# EAGLE design Qwiic Joystick v1.1.1 (EAGLE 9.1.3)
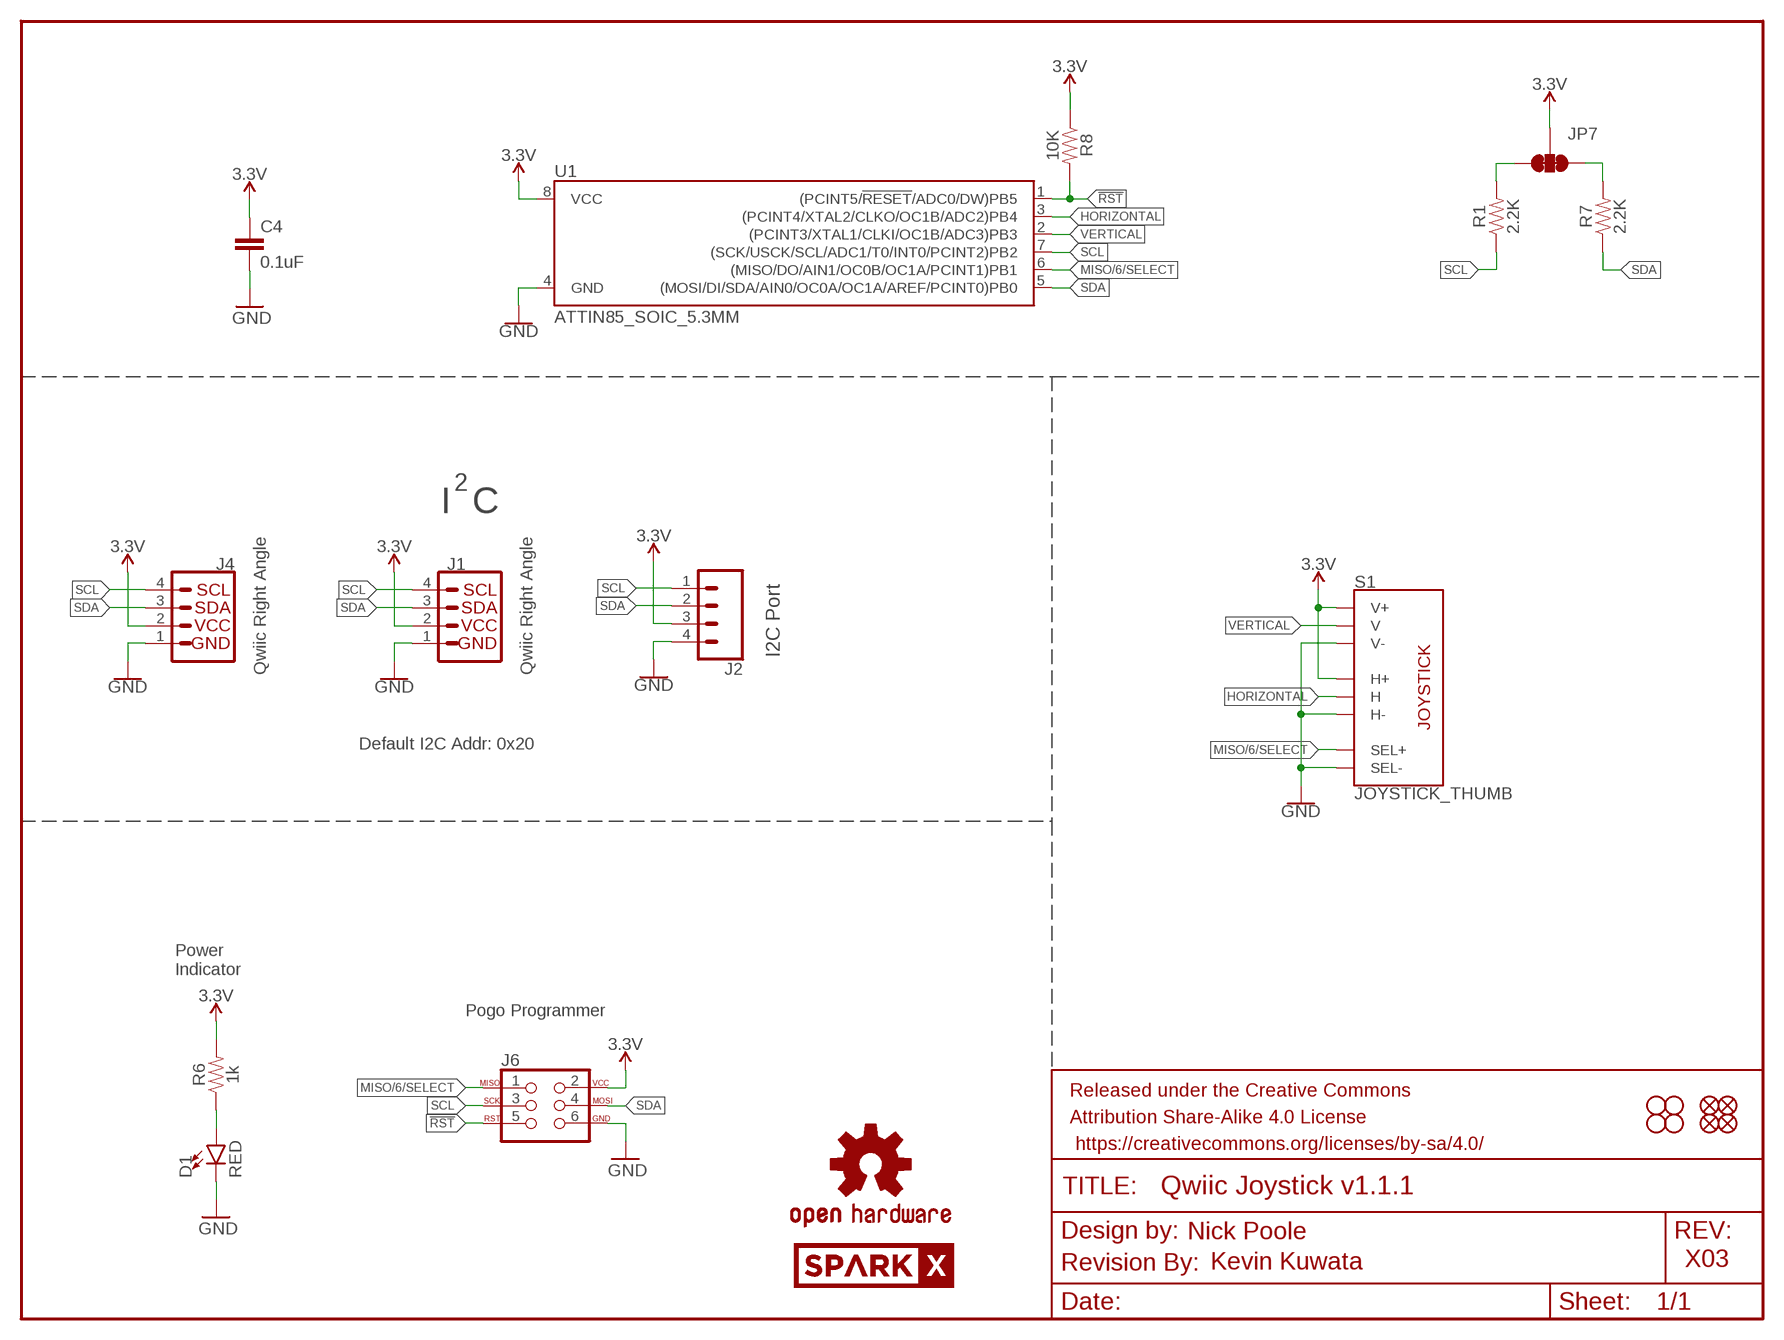
[diagram p0: schematic, sheet 1]

## Parts
C4  0.1uF  0.1UF-0603-25V-(+80/-20%)  [0603]
D1  RED  LED-RED0603  [LED-0603]
FRAME1  FRAME-LETTER  [CREATIVE_COMMONS]
H1  STAND-OFF  [STAND-OFF]
H2  STAND-OFF  [STAND-OFF]
H3  STAND-OFF  [STAND-OFF]
H4  STAND-OFF  [STAND-OFF]
J1  Qwiic Right Angle  I2C_STANDARDQWIIC  [1X04_1MM_RA]
J2  CONN_041X04_NO_SILK  [1X04_NO_SILK]
J4  Qwiic Right Angle  I2C_STANDARDQWIIC  [1X04_1MM_RA]
J6  AVR_SPI_PROG_3X2TESTPOINTS  [2X3_TEST_POINTS]
JP1  FIDUCIALUFIDUCIAL  [MICRO-FIDUCIAL]
JP2  FIDUCIALUFIDUCIAL  [MICRO-FIDUCIAL]
JP3  FIDUCIALUFIDUCIAL  [MICRO-FIDUCIAL]
JP6  FIDUCIALUFIDUCIAL  [MICRO-FIDUCIAL]
JP7  JUMPER-SMT_3_2-NC_TRACE_NO-SILK  [SMT-JUMPER_3_2-NC_TRACE_NO-SILK]
LOGO1  OSHW-LOGOMINI  [OSHW-LOGO-MINI]
LOGO2  REVISION  [REVISION]
R1  2.2K  4.7KOHM-0603-1/10W-1%  [0603]
R6  1k  1KOHM-0603-1/10W-1%  [0603]
R7  2.2K  4.7KOHM-0603-1/10W-1%  [0603]
R8  10K  330OHM-0603-1/10W-1%  [0603]
S1  JOYSTICK_THUMB  [JOYSTICK]
U1  ATTIN85_SOIC_5.3MM  [ATTINY85]
U$1  SPARKX-LOGO3  [SPARKX-SMALL]
U$2  SPARKX-LOGO3  [SPARKX-SMALL]

## Nets
3.3V: C4.1 J1.2 J2.3 J4.2 J6.2 JP7.2 R6.2 R8.1 S1.H1(H+) S1.V1(V+) U1.8(VCC)
!RST: J6.5 R8.2 U1.1((PCINT5/!RESET!/ADC0/DW)PB5)
GND: C4.2 D1.C J1.1 J2.4 J4.1 J6.6 S1.B2A(SEL-) S1.H3(H-) S1.V3(V-) U1.4(GND)
HORIZONTAL: S1.H2(H) U1.3((PCINT4/XTAL2/CLKO/OC1B/ADC2)PB4)
MISO/6/SELECT: J6.1 S1.B1A(SEL+) U1.6((MISO/DO/AIN1/OC0B/OC1A/PCINT1)PB1)
N$1: D1.A R6.1
N$2: JP7.1 R7.2
N$3: JP7.3 R1.2
SCL: J1.4 J2.1 J4.4 J6.3 R1.1 U1.7((SCK/USCK/SCL/ADC1/T0/INT0/PCINT2)PB2)
SDA: J1.3 J2.2 J4.3 J6.4 R7.1 U1.5((MOSI/DI/SDA/AIN0/OC0A/OC1A/AREF/PCINT0)PB0)
VERTICAL: S1.V2(V) U1.2((PCINT3/XTAL1/CLKI/OC1B/ADC3)PB3)

## Notes on the sheet
- 2
- I  C
- I2C Port
- Default I2C Addr: 0x20
- Power
  Indicator
- Pogo Programmer
- Nick Poole
- Kevin Kuwata | X03

## Library data of the parts
C4 = SparkFun-Capacitors:0.1UF: 0.1µF ceramic capacitors A capacitor is a passive two-terminal electrical component used to store electrical energy temporarily in an electric field.; PROD_ID: CAP-00810
D1 = SparkFun-LED:LED-RED: Red SMD LED Used in manufacturing of most products at SparkFun Packages: 0603 - SMD 0603 package [Product Link] <http://docs.avagotech.com/docs/AV02-0551EN> 0603 SMART - SMD 0603 SMART package ( more efficient and expensive)[Product Link] <http://www.osram-os.com/Graphics/XPic2/00077099_0.pdf> 1206 - SMD1206 package [Product Link] <https://www.sparkfun.com/datasheets/DevTools/LilyPad/Q150OVS4.pdff> SparkFun Products: Pro Mini 328 -5V <https://www.sparkfun.com/products/821> RedBoard <https://www.sparkfun.com/products/12757> IOIO-OTG <https://www.sparkfun.com/products/13613>; PROD_ID: DIO-00819
FRAME1 = SparkFun-Aesthetics:FRAME-LETTER: Schematic Frame - Letter Standard 8.5x11 US Letter frame
H1-H4 = SparkFun-Hardware:STAND-OFF: Stand Off Drill holes for mechanically mounting via screws, standoffs, etc. Note: Use the keepout ring to avoid running the screw head into surrounding components. Variant Overviews STAND-OFF - Mechanical footprint for a #4 phillips button head screw. STAND-OFF-TIGHT - Mechanical footprint for a #4 phillips button head screw, Example SparkFun Products Screw - Phillips Head (1/4", 4-40, 10 pack) <https://www.sparkfun.com/products/10453> (PRT-10453) Screw - Phillips Head (1/2", 4-40, 10 pack) <https://www.sparkfun.com/products/10452> (PRT-10452) Screw - Phillips Head (3/4", 4-40, 10 pack) <https://www.sparkfun.com/products/10451> (PRT-10451) Screw - Phillips Head (1", 4-40, 10 pack) <https://www.sparkfun.com/products/10450> (PRT-10450)
J1 J4 = SparkFun-Connectors:I2C_STANDARD: SparkFun I2C Standard Pinout Header SparkFun has standardized on a pinout for all I2C based sensor breakouts. This pinout allows I2C boards to be plugged directly into the headers on Arduino Uno compatible boards, and to be daisy chained easily. Example SparkFun Products: SparkFun Atmospheric Sensor Breakout - BME280 <https://www.sparkfun.com/products/13676> SparkFun Altitude/Pressure Sensor Breakout - MPL3115A2 <https://www.sparkfun.com/products/11084> SparkFun TOF Range Finder Sensor - VL6180 <https://www.sparkfun.com/products/12785>; PROD_ID: CONN-13694
J2 = SparkFun-Connectors:CONN_04: Multi connection point. Often used as Generic Header-pin footprint for 0.1 inch spaced/style header connections On any of the 0.1 inch spaced packages, you can populate with these: Break Away Headers - Straight <https://www.sparkfun.com/products/116> (PRT-00116) Break Away Male Headers - Right Angle <https://www.sparkfun.com/products/553> (PRT-00553) Female Headers <https://www.sparkfun.com/products/115> (PRT-00115) Break Away Headers - Machine Pin <https://www.sparkfun.com/products/117> (PRT-00117) Break Away Female Headers - Swiss Machine Pin <https://www.sparkfun.com/products/743> (PRT-00743) For SCREWTERMINALS and SPRING TERMINALS visit here: Screw Terimnals on SparkFun.com <https://www.sparkfun.com/search/results?term=Screw+Terminals> (5mm/3.5mm/2.54mm spacing) This device is also useful as a general connection point to wire up your design to another part of your project. Our various solder wires solder well into these plated through hole pads. Hook-Up Wire - Assortment (Stranded, 22 AWG) <https://www.sparkfun.com/products/11375> (PRT-11375) Hook-Up Wire - Assortment (Solid Core, 22 AWG) <https://www.sparkfun.com/products/11367> (PRT-11367) View the entire wire category on our website here <https://www.sparkfun.com/categories/141> Special notes: Molex polarized connector foot print use with SKU : PRT-08231 with associated crimp pins and housings. 1MM SMD Version SKU: PRT-10208; PROD_ID: CONN-09696
J6 = SparkFun-Connectors:AVR_SPI_PROG_3X2: AVR ISP 6 Pin This is the reduced ISP connector for AVR programming. Common on Arduino. This footprint will take up less PCB space and can be used with a 10-pin to 6-pin adapter such as SKU: BOB-08508 **Special note about "TEST_POINT" package. The stop mask is on the top side, so if you want your programming test points to be on the bottom of your board, make sure to place this package on the bottom side of the board. This also ensure that the orientation to program from the bottom side will be correct. SparkFun Products: SparkFun ISP Pogo Adapter <https://www.sparkfun.com/products/11591> - NS Tiny AVR Programmer <https://www.sparkfun.com/products/11801> -PTH
JP1-JP3 JP6 = SparkFun:FIDUCIAL: Fiducial Alignment Points Various fiducial points for machine vision alignment.
JP7 = SparkFun-Jumpers:JUMPER-SMT_3_2-NC_TRACE: Normally closed trace jumper (2 of 2 connections) This jumper has a trace between all three pads so they are normally closed (NC). Use a razor knife to open the connection(s). For best results follow the IPC guidelines for cutting traces: Cutout at least 0.063 mm (0.005 in). Remove all loose material to clean up the cut area. Seal the cut with an approved epoxy. Reapply solder to reclose the connection(s).
LOGO1 = SparkFun-Aesthetics:OSHW-LOGO: Open-Source Hardware (OSHW) Logo This logo indicates the piece of hardware it is found on incorporates a OSHW license and/or adheres to the definition of open source hardware found here: http://freedomdefined.org/OSHW
LOGO2 = SparkFun-Aesthetics:REVISION: "Revision By" Text Preceding text for revisor documentation. Includes schematic text on "symbols" layer, and board text on tDoc.
R1 R7 = SparkFun-Resistors:4.7KOHM: 4.7kΩ resistor A resistor is a passive two-terminal electrical component that implements electrical resistance as a circuit element. Resistors act to reduce current flow, and, at the same time, act to lower voltage levels within circuits. - Wikipedia; PROD_ID: RES-07857; VALUE: 4.7k
R6 = SparkFun-Resistors:1KOHM: 1kΩ resistor A resistor is a passive two-terminal electrical component that implements electrical resistance as a circuit element. Resistors act to reduce current flow, and, at the same time, act to lower voltage levels within circuits. - Wikipedia; PROD_ID: RES-07856
R8 = SparkFun-Resistors:330OHM: 330Ω resistor A resistor is a passive two-terminal electrical component that implements electrical resistance as a circuit element. Resistors act to reduce current flow, and, at the same time, act to lower voltage levels within circuits. - Wikipedia; PROD_ID: RES-00818; VALUE: 330
S1 = SparkFun-Switches:JOYSTICK_THUMB: Analog Thumb Joystick This is a joystick very similar to the ‘analog’ joysticks on PS2 (PlayStation 2) controllers. Directional movements are simply two potentiometers - one for each axis. Pots are ~10k each. This joystick also has a select button that is actuated when the joystick is pressed down. SparkFun Products Thumb Joystick <https://www.sparkfun.com/products/9032> (COM-09032) SparkFun Thumb Joystick Breakout <https://www.sparkfun.com/products/9110> (BOB-09110) SparkFun Joystick Shield Kit <https://www.sparkfun.com/products/9760> (DEV-09760); PROD_ID: COMP-09744; SF_SKU: COM-09032
U1 = attiny85:ATTIN85
U$1 U$2 = SparkX:SPARKX-LOGO

## Board
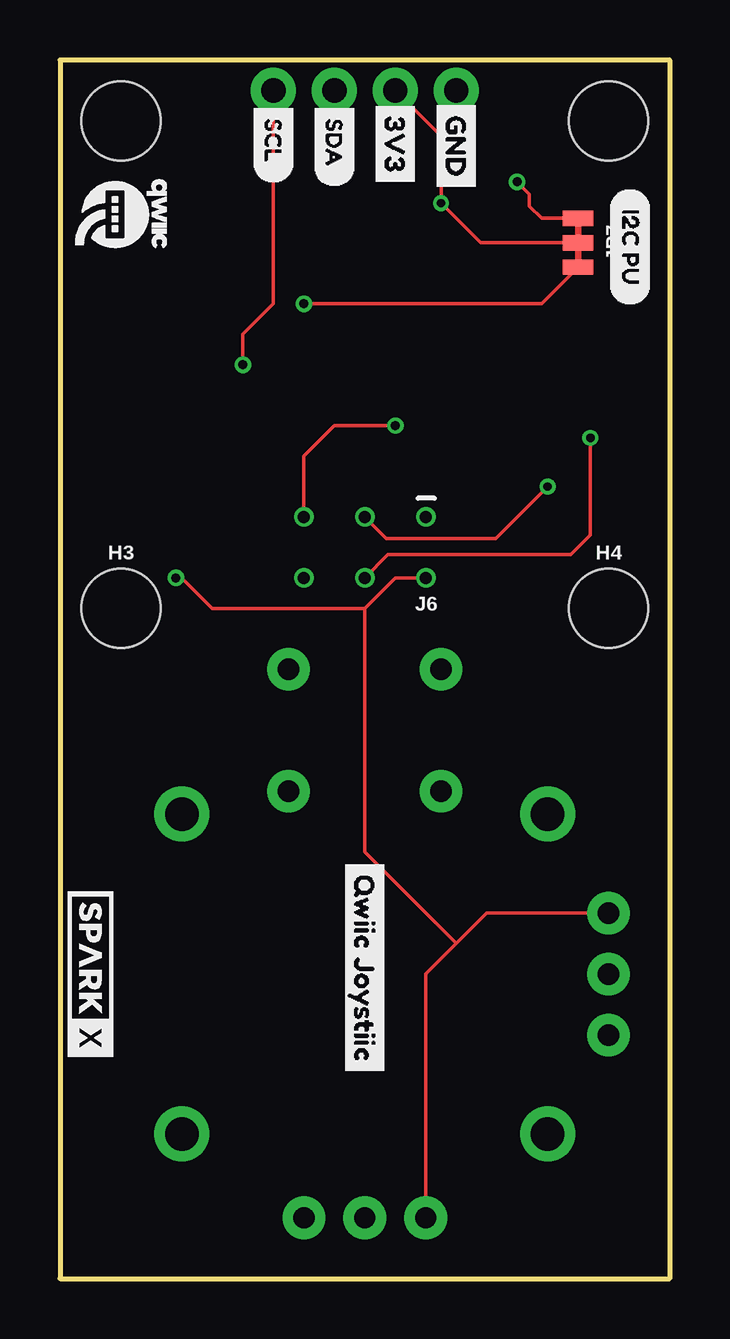
[diagram p1: board, top side]
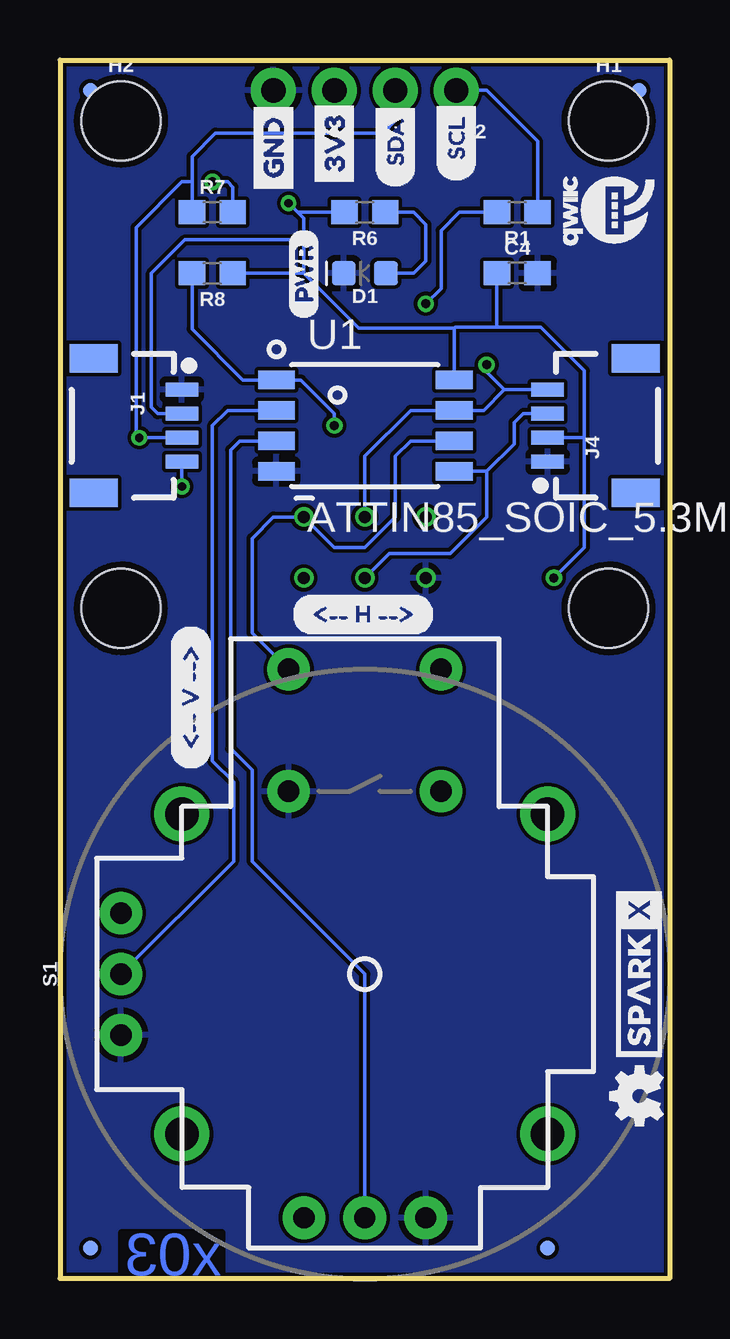
[diagram p2: board, bottom side, seen from below]

Size 25.4 x 50.8 mm. Coordinates in mm from the lower left corner, seen from the top.
Outline: 25.4,50.8 25.4,0 0,0 0,50.8 25.4,50.8
Copper layers (1*16): Top 0.035mm / dielectric 1.5mm / Bottom 0.035mm
Design rules "SparkFun-2-layer-PCBWay-LIMIT": minimum track width 6mil, minimum drill 0.3mm, track to track 6mil, track to pad 6mil, pad to pad 6mil, via to via 6mil, smd to smd 6mil, copper to edge 6mil, drill to drill 6mil, minimum pad ring 6mil, minimum via ring 6mil, stop-mask expansion 4mil, vias tented up to drill 25mil, thermal gap 10mil

### Footprints (pad centres in the part's own frame; a part is rotated, then mirrored left to right if it is on the bottom)
0603 = smd 1.1 x 1: 1 -0.85,0; 2 0.85,0
LED-0603 = smd 1 x 1: A -0.877,0; C 0.877,0
STAND-OFF = hole 3.302: 0,0
1X04_1MM_RA = smd 0.6 x 1.35: 1 -1.5,0; 2 -0.5,0; 3 0.5,0; 4 1.5,0 | smd 1.2 x 2: NC1 2.8,-3.675; NC2 -2.8,-3.675
1X04_NO_SILK = drill 1.016 pad 1.88: 1 0,0; 2 2.54,0; 3 5.08,0; 4 7.62,0
2X3_TEST_POINTS = drill 0.508: 1 -2.54,-1.27; 2 -2.54,1.27; 3 0,-1.27; 4 0,1.27; 5 2.54,-1.27; 6 2.54,1.27
MICRO-FIDUCIAL = smd 0.635 x 0.635: 1 0,0
SMT-JUMPER_3_2-NC_TRACE_NO-SILK = smd 0.635 x 1.27: 1 -1.016,0; 2 0,0; 3 1.016,0
JOYSTICK = drill 0.9 pad 1.778: B1A -3.175,12.7; B1B 3.175,12.7; B2A -3.175,7.62; B2B 3.175,7.62 | drill 0.889 pad 1.778: H1 -2.54,-10.16; H2 0,-10.16; H3 2.54,-10.16; V1 -10.16,2.54; V2 -10.16,0; V3 -10.16,-2.54 | drill 1.397 pad 2.286: MOUNT1 -7.62,6.668; MOUNT2 -7.62,-6.668; MOUNT3 7.62,-6.668; MOUNT4 7.62,6.668
ATTINY85 = smd 1.524 x 0.762: 1 -3.683,1.905; 2 -3.683,0.635; 3 -3.683,-0.635; 4 -3.683,-1.905; 5 3.727,-1.905; 6 3.727,-0.635; 7 3.727,0.635; 8 3.727,1.905

### Placement (x,y rotation side)
C4  6.35,41.91 0 bottom
D1  12.7,41.91 180 bottom
FRAME1  38.1,-12.7 0 bottom  (outside the outline)
H1  2.54,48.26 0 bottom
H2  22.86,48.26 0 bottom
H3  2.54,27.94 0 top
H4  22.86,27.94 0 top
J1  20.32,35.56 270 bottom
J2  8.89,49.53 180 bottom
J4  5.08,35.56 90 bottom
J6  12.7,30.48 180 top
JP1  1.27,49.53 270 bottom
JP2  24.13,1.27 0 bottom
JP3  5.08,1.27 270 bottom
JP6  24.13,49.53 270 bottom
JP7  21.59,43.18 270 top
LOGO1  1.27,7.62 90 bottom
LOGO2  39.37,-19.05 0 bottom  (outside the outline)
R1  6.35,44.45 180 bottom
R6  12.7,44.45 180 bottom
R7  19.05,44.45 0 bottom
R8  19.05,41.91 180 bottom
S1  12.7,12.7 0 bottom
U1  12.7,35.56 0 bottom
U$1  1.27,12.7 90 bottom
U$2  1.27,12.7 270 top
U$3  [QWIIC_JOYSTIIC6]  12.7,17.78 270 top
U$4  [I2C_PU0]  23.75,45.47 270 top
U$5  [SDA0]  11.43,49.28 270 top
U$6  [GND4]  16.51,44.96 90 bottom
U$7  [###_V_###0]  19.94,21.21 90 bottom
U$8  [GND4]  16.51,49.4 270 top
U$9  [SCL1]  8.89,49.28 270 top
U$10  [QWIIC-LOGO-SMALL]  2.54,44.45 270 top
U$11  [SCL3]  8.89,45.72 90 bottom
U$12  [SDA2]  11.43,45.47 90 bottom
U$14  [PWR-()-03]  15.24,40.01 90 bottom
U$15  [###_H_###1]  15.75,27.69 0 bottom
U$16  [3V35]  13.97,45.21 90 bottom
U$17  [3V35]  13.97,49.4 270 top
U$22  [QWIIC-LOGO-SMALL]  2.54,44.45 90 bottom

### Tracks (layer width: path | path; a pad name or v marks a point on that pad's centre or on a via)
3.3V  (via drill 0.35, 0.38)
  Top 0.152: S1.V1 17.78,15.24 16.51,13.97 | 16.51,13.97 15.24,12.7 S1.H1 | 16.51,13.97 12.7,17.78 12.7,27.94 | J6.2 13.97,29.21 12.7,27.94 | 12.7,27.94 6.35,27.94 5.08,29.21 v4.83,29.21 | JP7.2 17.53,43.18 v15.88,44.83 15.88,47.62 J2.3
  Bottom 0.152: 3.56,35.05 3.56,37.85 5.38,39.67 7.24,39.67 | 3.56,35.05 3.56,30.48 v4.83,29.21 | J4.2 3.56,35.06 3.56,35.05 | R6.2 15.49,44.45 v15.88,44.83 15.24,44.2 15.24,43.31 | 15.24,41.91 12.95,39.62 8.97,39.62 | J1.2 21.33,36.06 21.59,36.32 21.59,41.91 20.19,43.31 15.24,43.31 | 15.24,41.91 15.24,43.31 | U1.8 8.97,39.62 | 8.97,39.62 8.93,39.67 7.24,39.67 | R8.1 15.24,41.91 | C4.1 7.2,39.7 7.24,39.67
!RST  (via drill 0.38)
  Top 0.152: J6.5 10.16,34.29 11.43,35.56 v13.97,35.56
  Bottom 0.152: R8.2 19.9,39.59 17.78,37.47 U1.1 15.37,37.47 13.97,36.07 v13.97,35.56
GND
  pour Bottom: 25.4,0 0,0 0,50.8 25.4,50.8
  pour Bottom (isolate 0.305): 0,0 25.4,0 25.4,50.8 0,50.8
HORIZONTAL
  Bottom 0.152: U1.3 17.91,34.92 18.29,34.54 18.29,22.1 17.4,21.21 17.4,17.4 12.7,12.7 S1.H2
MISO/6/SELECT
  Bottom 0.152: U1.6 10.79,34.92 11.43,34.29 11.43,31.75 12.7,30.48 13.97,30.48 J6.1 16.51,31.75 17.4,30.86 17.4,26.92 S1.B1A
N$1
  Bottom 0.152: D1.A 10.67,41.91 10.16,42.42 10.16,43.94 10.67,44.45 R6.1
N$2  (via drill 0.38)
  Top 0.152: JP7.1 20.07,44.2 19.56,44.7 19.56,45.21 v19.05,45.72
  Bottom 0.152: R7.2 18.2,45.51 18.41,45.72 v19.05,45.72
N$3  (via drill 0.38)
  Top 0.152: JP7.3 20.07,40.64 v10.16,40.64
  Bottom 0.152: R1.2 8.76,44.45 9.53,43.69 9.53,41.27 v10.16,40.64
SCL  (via drill 0.35, 0.38)
  Top 0.152: J2.1 8.89,40.64 7.62,39.37 v7.62,38.1 | v20.32,33.02 18.16,30.86 13.59,30.86 J6.3
  Bottom 0.152: J4.4 6.88,37.06 | 6.88,37.06 7.75,36.2 U1.7 10.79,36.2 12.7,34.29 J6.3 | J2.1 7.62,49.53 5.5,47.41 R1.1 | J1.4 v20.32,33.02 | 6.88,37.06 7.62,37.8 v7.62,38.1
SDA  (via drill 0.35)
  Top 0.152: J6.4 13.66,30.18 21.29,30.18 22.1,30.99 v22.1,35.05
  Bottom 0.152: J4.3 6.1,36.07 6.48,35.69 6.48,34.8 7.62,33.66 | J2.2 11.43,48.26 11.94,47.75 18.92,47.75 19.9,46.77 19.9,45.72 | J1.3 v22.09,35.06 v22.1,35.05 22.23,35.18 22.23,43.81 20.32,45.72 19.9,45.72 | U1.5 7.62,33.66 | R7.1 19.9,45.72 | J6.4 11.68,30.23 9.14,30.23 7.62,31.75 7.62,33.66
VERTICAL
  Bottom 0.152: U1.2 18.41,36.2 19.05,35.56 19.05,21.59 18.16,20.7 18.16,17.4 S1.V2

### Text on the board
Bottom: x03
bDocu: Nick Poole | Kevin Kuwata